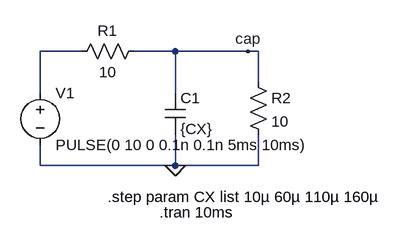
[diagram p0: schematic Draft5.asc]
Draft5.asc, the LTspice schematic file:
Version 4
SHEET 1 880 680
WIRE 288 80 224 80
WIRE 432 80 368 80
WIRE 544 80 432 80
WIRE 560 80 544 80
WIRE 560 128 560 80
WIRE 224 144 224 80
WIRE 432 144 432 80
WIRE 224 256 224 224
WIRE 432 256 432 208
WIRE 432 256 224 256
WIRE 560 256 560 208
WIRE 560 256 432 256
FLAG 432 256 0
FLAG 544 80 cap
SYMBOL voltage 224 128 R0
WINDOW 123 0 0 Left 0
WINDOW 39 0 0 Left 0
SYMATTR InstName V1
SYMATTR Value PULSE(0 10 0 0.1n 0.1n 5ms 10ms)
SYMBOL res 544 112 R0
SYMATTR InstName R2
SYMATTR Value 10
SYMBOL cap 416 144 R0
SYMATTR InstName C1
SYMATTR Value {CX}
SYMBOL res 384 64 R90
WINDOW 0 0 56 VBottom 2
WINDOW 3 32 56 VTop 2
SYMATTR InstName R1
SYMATTR Value 10
TEXT 328 304 Left 2 !.step param CX list 10µ 60µ 110µ 160µ
TEXT 408 328 Left 2 !.tran 10ms

The netlist it stands for:
* Draft5.asc
V1 N001 0 PULSE(0 10 0 0.1n 0.1n 5ms 10ms)
R2 cap 0 10
C1 cap 0 {CX}
R1 cap N001 10
.step param CX list 10µ 60µ 110µ 160µ
.tran 10ms
.backanno
.end